# EAGLE design LED sign board 3 (EAGLE 7.2.0)
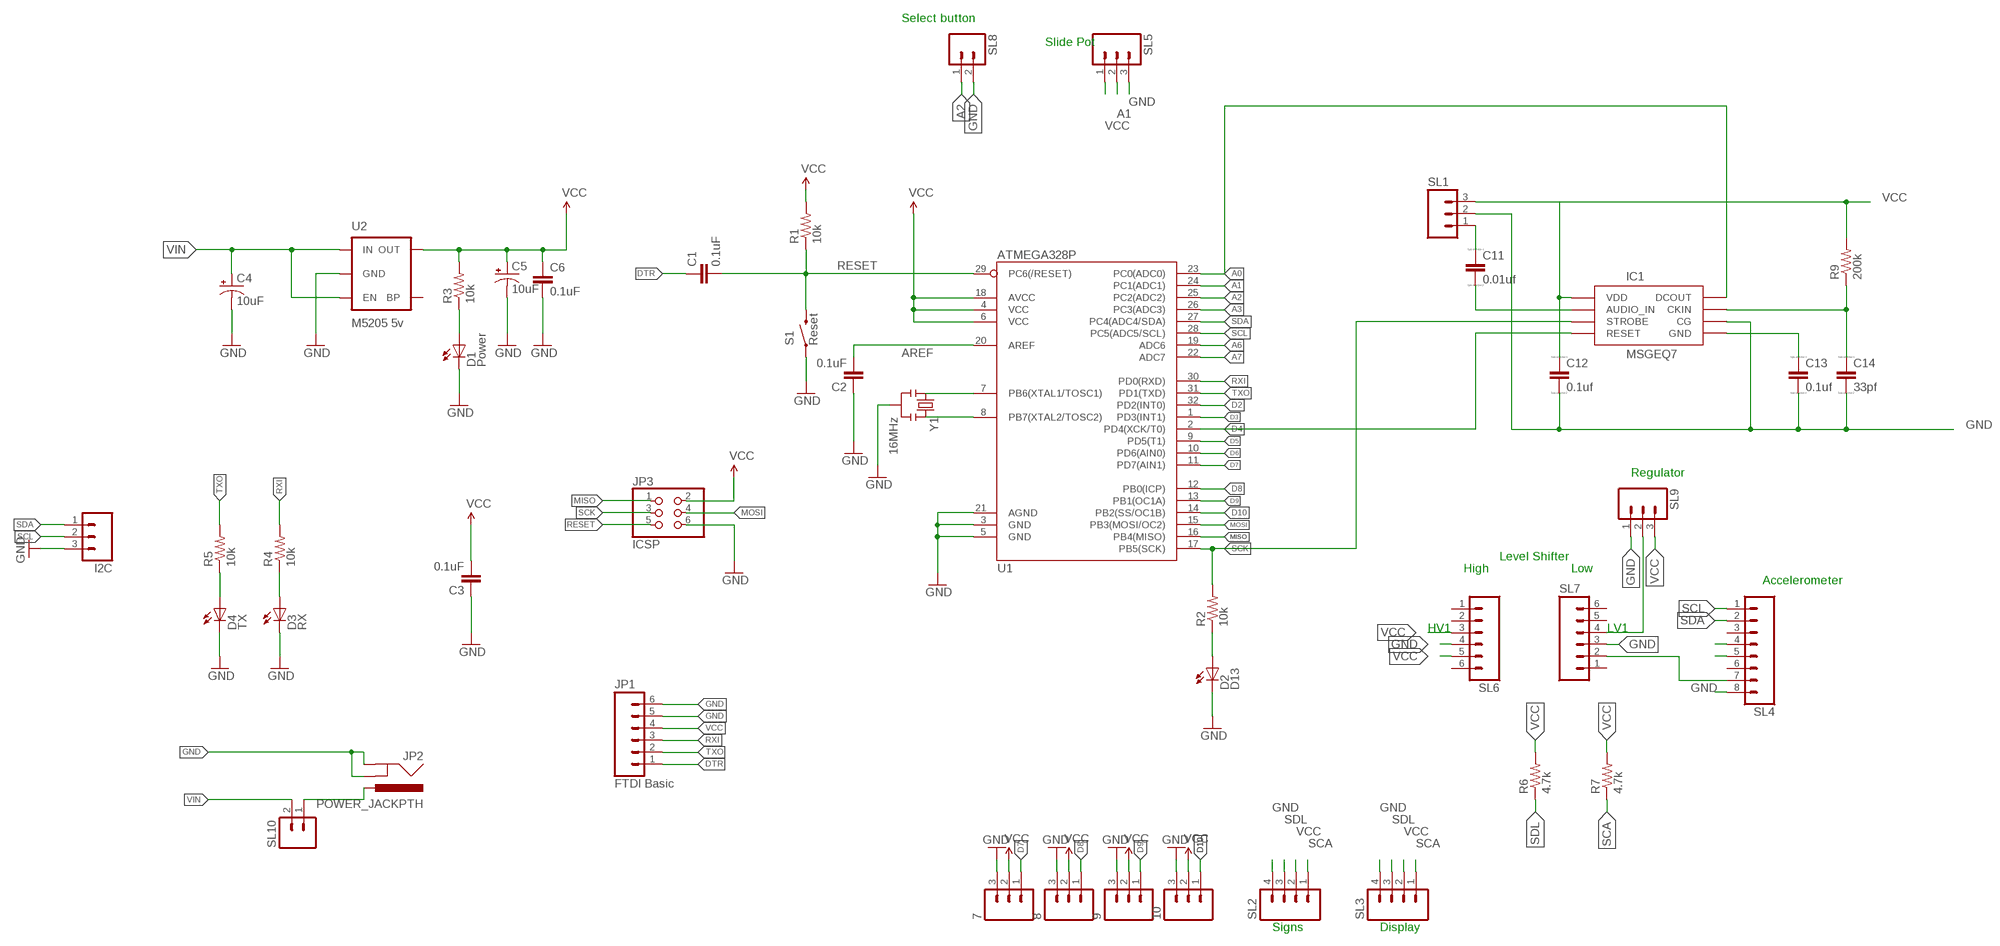
[diagram p0: schematic, sheet 1]

## Parts
7  M03PTH  [1X03]
8  M03PTH  [1X03]
9  M03PTH  [1X03]
10  M03PTH  [1X03]
C1  0.1uF  CAP0603-CAP  [0603-CAP]
C2  0.1uF  CAP0603-CAP  [0603-CAP]
C3  0.1uF  CAP0603-CAP  [0603-CAP]
C4  10uF  CAP_POL1206  [EIA3216]
C5  10uF  CAP_POL1206  [EIA3216]
C6  0.1uF  CAP0603-CAP  [0603-CAP]
C11  0.01uf  CC0201  [C0201]
C12  0.1uf  CC0201  [C0201]
C13  0.1uf  CC0201  [C0201]
C14  33pf  CC0201  [C0201]
D1  Power  LED-RED0603  [LED-0603]
D2  D13  LED-RED0603  [LED-0603]
D3  RX  LED-GREEN0603  [LED-0603]
D4  TX  LED-RED0603  [LED-0603]
I2C  M03PTH  [1X03]
IC1  MSGEQ7DIL  [DIL-08]
JP1  FTDI Basic  M06SIP  [1X06]
JP2  POWER_JACKPTH  [POWER_JACK_PTH]
JP3  ICSP  PINHD-2X3  [2X03]
R1  10k  RESISTOR0603-RES  [0603-RES]
R2  10k  RESISTOR0603-RES  [0603-RES]
R3  10k  RESISTOR0603-RES  [0603-RES]
R4  10k  RESISTOR0603-RES  [0603-RES]
R5  10k  RESISTOR0603-RES  [0603-RES]
R6  4.7k  RESISTOR1206  [1206]
R7  4.7k  RESISTOR1206  [1206]
R9  200k  RESISTOR1206  [1206]
S1  Reset  SWITCH-MOMENTARY-2SMD  [TACTILE_SWITCH_SMD]
SL1  M03  [03P]
SL2  M04  [04P]
SL3  M04  [04P]
SL4  M08  [08P]
SL5  M03  [03P]
SL6  M06  [06P]
SL7  M06  [06P]
SL8  M02  [02P]
SL9  M03  [03P]
SL10  M02  [02P]
U1  ATMEGA328P  ATMEGA328_SMT  [TQFP32-08]
U2  M5205 5v  MIC52055V  [SOT23-5]
Y1  16MHz  RESONATOR16MHZ  [RESONATOR-SMD]

## Nets
A0: IC1.3(DCOUT) U1.23(PC0(ADC0))
A1: SL5.2 U1.24(PC1(ADC1))
A2: SL8.1 U1.25(PC2(ADC2))
A3: U1.26(PC3(ADC3))
A6: U1.19(ADC6)
A7: U1.22(ADC7)
AREF: C2.2 U1.20(AREF)
D2: U1.32(PD2(INT0))
D3: U1.1(PD3(INT1))
D4: IC1.7(RESET) U1.2(PD4(XCK/T0))
D5: U1.9(PD5(T1))
D6: U1.10(PD6(AIN0))
D7: 7.1 U1.11(PD7(AIN1))
D8: 8.1 U1.12(PB0(ICP))
D9: 9.1 U1.13(PB1(OC1A))
D10: 10.1 U1.14(PB2(SS/OC1B))
DTR: C1.1 JP1.1
GND: 7.3 8.3 9.3 10.3 C2.1 C3.1 C4.C(-) C5.C(-) C6.2 C12.2 C13.2 C14.2 D1.C D2.C D3.C D4.C I2C.3 IC1.6(CG) JP1.5 JP1.6 JP2.GND JP2.GNDBREAK JP3.6 S1.1 SL1.2 SL2.4 SL3.4 SL4.8 SL5.3 SL6.4 SL7.3 SL7.4 SL8.2 SL9.1 SL9.2 U1.3(GND) U1.5(GND) U1.21(AGND) U2.2(GND) Y1.2
MISO: JP3.1 U1.16(PB4(MISO))
MOSI: JP3.4 U1.15(PB3(MOSI/OC2))
N$1: U1.7(PB6(XTAL1/TOSC1)) Y1.1
N$2: U1.8(PB7(XTAL2/TOSC2)) Y1.3
N$3: D1.A R3.1
N$4: D2.A R2.1
N$5: D3.A R4.1
N$6: D4.A R5.1
N$7: SL4.7 SL7.2
N$8: JP2.PWR SL10.1
N$9: C11.1 SL1.1
N$10: C11.2 IC1.5(AUDIO_IN)
N$11: C13.1 IC1.2(GND)
N$12: C14.1 IC1.8(CKIN) R9.1
N$14: SL4.5
N$15: SL4.4
RESET: C1.2 JP3.5 R1.1 S1.3 U1.29(PC6(/RESET))
RXI: JP1.3 R4.2 U1.30(PD0(RXD))
SCA: R7.1 SL2.1 SL3.1
SCK: IC1.4(STROBE) JP3.3 R2.2 U1.17(PB5(SCK))
SCL: I2C.2 SL4.1 U1.28(PC5(ADC5/SCL))
SDA: I2C.1 SL4.2 U1.27(PC4(ADC4/SDA))
SDL: R6.1 SL2.3 SL3.3
TXO: JP1.2 R5.2 U1.31(PD1(TXD))
VCC: 7.2 8.2 9.2 10.2 C3.2 C5.A(+) C6.1 C12.1 IC1.1(VDD) JP1.4 JP3.2 R1.2 R3.2 R6.2 R7.2 R9.2 SL1.3 SL2.2 SL3.2 SL5.1 SL6.3 SL6.5 SL9.3 U1.4(VCC) U1.6(VCC) U1.18(AVCC) U2.5(OUT)
VIN: C4.A(+) SL10.2 U2.1(IN) U2.3(EN)
Unconnected: SL4.3 SL4.6 SL6.1 SL6.2 SL6.6 SL7.1 SL7.5 SL7.6 U2.4(BP)

## Notes on the sheet
- Select button
- Slide Pot
- Regulator
- Level Shifter
- High | Low
- Accelerometer
- HV1 | LV1
- Signs | Display

## Library data of the parts
7-10 I2C = SparkFun-Connectors:M03: Header 3 Standard 3-pin 0.1" header. Use with straight break away headers (SKU : PRT-00116), right angle break away headers (PRT-00553), swiss pins (PRT-00743), machine pins (PRT-00117), and female headers (PRT-00115). Molex polarized connector foot print use with SKU : PRT-08232 with associated crimp pins and housings.
C1-C3 C6 = SparkFun-Passives:CAP: Capacitor Standard 0603 ceramic capacitor, and 0.1" leaded capacitor.
C4 C5 = SparkFun-Passives:CAP_POL: Capacitor Polarized These are standard SMD and PTH capacitors. Normally 10uF, 47uF, and 100uF in electrolytic and tantalum varieties. Always verify the external diameter of the through hole cap, it varies with capacity, voltage, and manufacturer. The EIA devices should be standard.
C11-C14 = eagle-ltspice:C: CAPACITOR, European symbol; SPICEMODEL: NONE; SPICEPREFIX: C
D1 D2 D4 = SparkFun-LED:LED-RED: Assorted Red LEDs LilyPad 1206- DIO-09912 1206- DIO-00809 0603- DIO-00819; PROD_ID: DIO-00819; VALUE: RED
D3 = SparkFun-LED:LED-GREEN: Various green LEDs Green LEDs used in SFE Production 0603- DIO-00821 LARGE- DIO-00862 LILYPAD- DIO-09910; PROD_ID: DIO-00821; VALUE: GREEN
IC1 = SparkFun-AnalogIC:MSGEQ7: 7-band graphic equalizer
JP1 = SparkFun-Connectors:M06: Header 6 Standard 6-pin 0.1" header. Use with straight break away headers (SKU : PRT-00116), right angle break away headers (PRT-00553), swiss pins (PRT-00743), machine pins (PRT-00117), and female headers (PRT-00115). Molex polarized connector foot print use with SKU : PRT-08094 with associated crimp pins and housings. NOTES ON THE VARIANTS LOCK and LOCK_LONGPADS... This footprint was designed to help hold the alignment of a through-hole component (i.e. 6-pin header) while soldering it into place. You may notice that each hole has been shifted either up or down by 0.005 of an inch from it's more standard position (which is a perfectly straight line). This slight alteration caused the pins (the squares in the middle) to touch the edges of the holes. Because they are alternating, it causes a "brace" to hold the component in place. 0.005 has proven to be the perfect amount of "off-center" position when using our standard breakaway headers. Although looks a little odd when you look at the bare footprint, once you have a header in there, the alteration is very hard to notice. Also,if you push a header all the way into place, it is covered up entirely on the bottom side. This idea of altering the position of holes to aid alignment will be further integrated into the Sparkfun Library for other footprints. It can help hold any component with 3 or more connection pins.
JP2 = SparkFun-Connectors:POWER_JACK: Power Jack This is the standard 5.5mm barrel jack for power. The PTH is the most common, proven, reliable, footprint. The Slot footprint only works if the mill layer is transmitted to the PCB fab house so be warned. Mating wall wart : TOL-00298 (and others); PROD_ID: CONN-08197
JP3 = SparkFun-Connectors:PINHD-2X3: PIN HEADER
R1-R5 = SparkFun-Passives:RESISTOR: Resistor Basic schematic elements and footprints for 0603, 1206, and PTH resistors.
R6 R7 R9 = SparkFun-Resistors:RESISTOR: Resistor Basic schematic elements and footprints for 0603, 1206, and PTH resistors.
S1 = SparkFun-Electromechanical:SWITCH-MOMENTARY-2: Various NO switches- pushbuttons, reed, etc; PROD_ID: SWCH-08247
SL1 SL5 SL9 = con-amp-quick:M03: AMP QUICK CONNECTOR; OC_FARNELL: unknown; OC_NEWARK: unknown
SL2 SL3 = con-amp-quick:M04: AMP QUICK CONNECTOR; OC_FARNELL: unknown; OC_NEWARK: unknown
SL4 = con-amp-quick:M08: AMP QUICK CONNECTOR; OC_FARNELL: unknown; OC_NEWARK: unknown
SL6 SL7 = con-amp-quick:M06: AMP QUICK CONNECTOR; OC_FARNELL: unknown; OC_NEWARK: unknown
SL8 SL10 = con-amp-quick:M02: AMP QUICK CONNECTOR; OC_FARNELL: unknown; OC_NEWARK: unknown
U1 = SparkFun-DigitalIC:ATMEGA328_SMT: 32-Pin Atmega328 part Commonly used on Arduino compatible boards Available in QFP and QFN packages TQFP is IC-09069 QFN is non-stock; PROD_ID: IC-09069
U2 = SparkFun-PowerIC:MIC5205: MIC5205 150mA vreg 3.3V - VREG-00822 5V - VREG-00823; PROD_ID: VREG-00823
Y1 = SparkFun-FreqCtrl:RESONATOR: Resonator Small SMD resonator. Used, eg, on the Arduino Pro/ Pro Mini boards. 8MHz- XTAL-08895 16MHz- XTAL-08900; PROD_ID: XTAL-08900

## Board
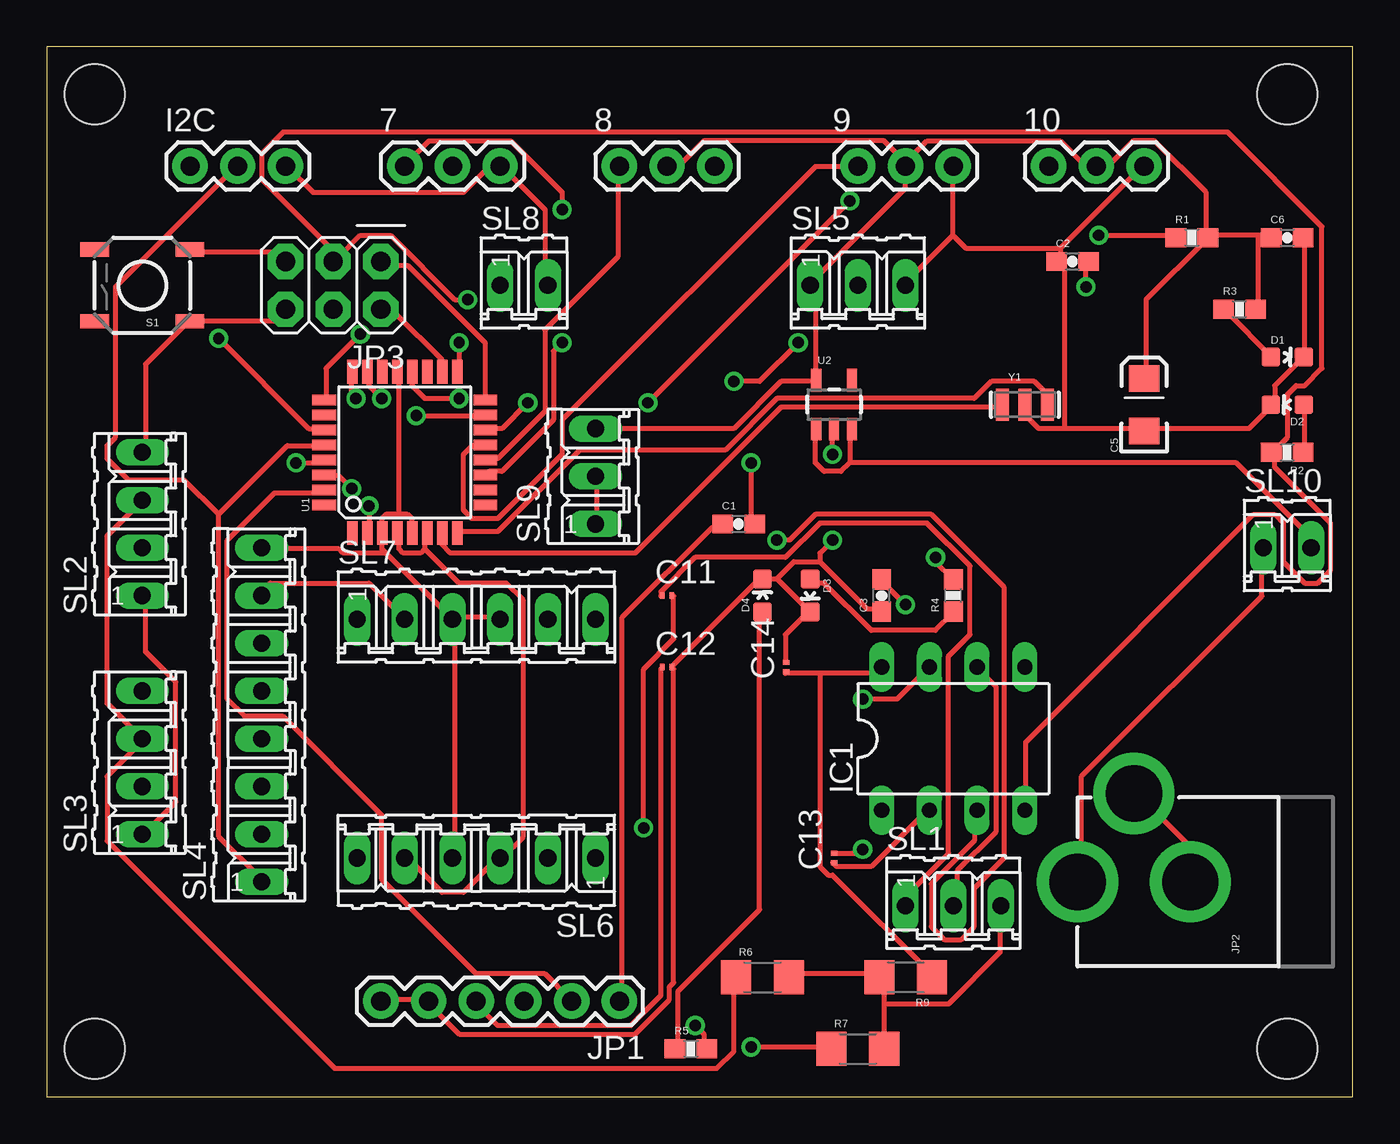
[diagram p1: board, top side]
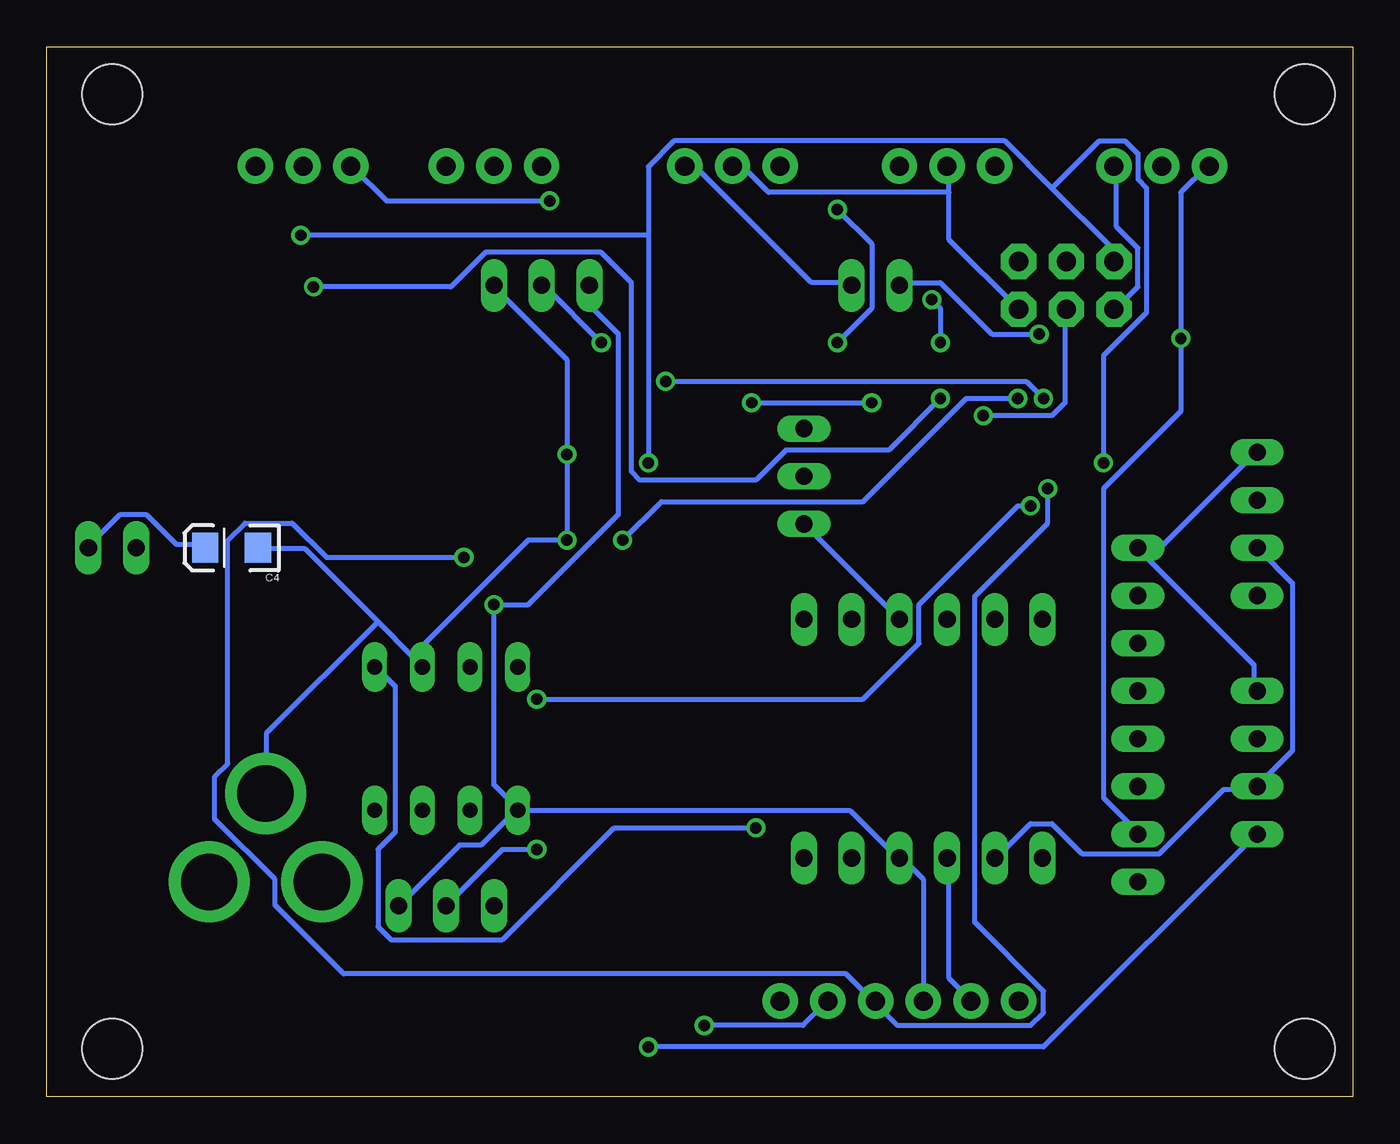
[diagram p2: board, bottom side, seen from below]

Size 69.52 x 55.87 mm. Coordinates in mm from the lower left corner, seen from the top.
Outline: 0,0 69.52,0 69.52,55.87 0,55.87 0,0
Copper layers (1*16): Top 0.035mm / dielectric 1.5mm / Bottom 0.035mm
Design rules "default": minimum track width 10mil, minimum drill 24mil, track to track 8mil, track to pad 8mil, pad to pad 8mil, via to via 8mil, smd to smd 8mil, copper to edge 40mil, drill to drill 8mil, minimum pad ring 10mil, minimum via ring 8mil, stop-mask expansion 4mil, vias tented up to drill 0mil, thermal gap 10mil
Holes 3.2 mm at 2.54,2.54 66.04,2.54 2.54,53.34 66.04,53.34

### Footprints (pad centres in the part's own frame; a part is rotated, then mirrored left to right if it is on the bottom)
1X03 = drill 1.016 pad 1.88: 1 0,0; 2 2.54,0; 3 5.08,0
0603-CAP = smd 1.1 x 1: 1 -0.85,0; 2 0.85,0
EIA3216 = smd 1.4 x 1.6: A 1.4,0; C -1.4,0
C0201 = smd 0.25 x 0.35: 1 -0.25,0; 2 0.25,0
LED-0603 = smd 1 x 1: A 0,-0.877; C 0,0.877
DIL-08 = drill 0.813 long: 1 -3.81,-3.81; 2 -1.27,-3.81; 3 1.27,-3.81; 4 3.81,-3.81; 5 3.81,3.81; 6 1.27,3.81; 7 -1.27,3.81; 8 -3.81,3.81
1X06 = drill 1.016 pad 1.88: 1 0,0; 2 2.54,0; 3 5.08,0; 4 7.62,0; 5 10.16,0; 6 12.7,0
POWER_JACK_PTH = drill 2.997 pad 4.318: GND 0,7.7; GNDBREAK 4.7,10.7; PWR 0,13.7
2X03 = drill 1.016 pad 1.88 octagon: 1 -2.54,-1.27; 2 -2.54,1.27; 3 0,-1.27; 4 0,1.27; 5 2.54,-1.27; 6 2.54,1.27
0603-RES = smd 1.1 x 1: 1 -0.85,0; 2 0.85,0
1206 = smd 1.6 x 1.8: 1 -1.4,0; 2 1.4,0
TACTILE_SWITCH_SMD = smd 1.524 x 0.762: 1 -2.54,1.905; 2 2.54,1.905; 3 -2.54,-1.905; 4 2.54,-1.905
03P = drill 0.914 long: 1 -2.54,0; 2 0,0; 3 2.54,0
04P = drill 0.914 long: 1 -3.81,0; 2 -1.27,0; 3 1.27,0; 4 3.81,0
08P = drill 0.914 long: 1 -8.89,0; 2 -6.35,0; 3 -3.81,0; 4 -1.27,0; 5 1.27,0; 6 3.81,0; 7 6.35,0; 8 8.89,0
06P = drill 0.914 long: 1 -6.35,0; 2 -3.81,0; 3 -1.27,0; 4 1.27,0; 5 3.81,0; 6 6.35,0
02P = drill 0.914 long: 1 -1.27,0; 2 1.27,0
TQFP32-08 = smd 1.27 x 0.559: 1 -4.293,2.8; 2 -4.293,2; 3 -4.293,1.2; 4 -4.293,0.4; 5 -4.293,-0.4; 6 -4.293,-1.2; 7 -4.293,-2; 8 -4.293,-2.8; 17 4.293,-2.8; 18 4.293,-2; 19 4.293,-1.2; 20 4.293,-0.4; 21 4.293,0.4; 22 4.293,1.2; 23 4.293,2; 24 4.293,2.8 | smd 0.559 x 1.27: 9 -2.8,-4.293; 10 -2,-4.293; 11 -1.2,-4.293; 12 -0.4,-4.293; 13 0.4,-4.293; 14 1.2,-4.293; 15 2,-4.293; 16 2.8,-4.293; 25 2.8,4.293; 26 2,4.293; 27 1.2,4.293; 28 0.4,4.293; 29 -0.4,4.293; 30 -1.2,4.293; 31 -2,4.293; 32 -2.8,4.293
SOT23-5 = smd 0.55 x 1.2: 1 -0.95,-1.3; 2 0,-1.3; 3 0.95,-1.3; 4 0.95,1.3; 5 -0.95,1.3
RESONATOR-SMD = smd 0.7 x 1.7: 1 -1.2,0; 2 0,0; 3 1.2,0

### Placement (x,y rotation side)
7  19.05,49.53 0 top
8  30.48,49.53 0 top
9  43.18,49.53 0 top
10  53.34,49.53 0 top
C1  36.83,30.48 0 top
C2  54.61,44.45 0 top
C3  44.45,26.67 90 top
C4  59.69,29.21 180 bottom
C5  58.42,36.83 90 top
C6  66.04,45.72 0 top
C11  33.02,26.67 0 top
C12  33.02,22.86 0 top
C13  41.91,12.7 90 top
C14  39.37,22.86 90 top
D1  66.04,39.37 270 top
D2  66.04,36.83 90 top
D3  40.64,26.67 180 top
D4  38.1,26.67 0 top
I2C  7.62,49.53 0 top
IC1  48.26,19.05 0 top
JP1  30.48,5.08 180 top
JP2  68.58,11.43 90 top
JP3  15.24,43.18 180 top
R1  60.96,45.72 0 top
R2  66.04,34.29 180 top
R3  63.5,41.91 0 top
R4  48.26,26.67 90 top
R5  34.29,2.54 0 top
R6  38.1,6.35 0 top
R7  43.18,2.54 0 top
R9  45.72,6.35 180 top
S1  5.08,43.18 180 top
SL1  48.26,10.16 0 top
SL2  5.08,30.48 90 top
SL3  5.08,17.78 90 top
SL4  11.43,20.32 90 top
SL5  43.18,43.18 0 top
SL6  22.86,12.7 180 top
SL7  22.86,25.4 0 top
SL8  25.4,43.18 0 top
SL9  29.21,33.02 90 top
SL10  66.04,29.21 0 top
U1  19.05,34.29 90 top
U2  41.91,36.83 0 top
Y1  52.07,36.83 0 top

### Tracks (layer width: path | path; a pad name or v marks a point on that pad's centre or on a via)
A0  (via drill 0.61)
  Top 0.254: v17.83,37.16 17.14,37.85 17.14,38.53 U1.23 | v38.86,29.62 39.55,29.62 40.92,30.99 47.09,30.99 50.98,27.1 50.98,12.7 49.38,11.1 49.38,9.04 48.69,8.36 47.78,8.36 47.09,9.04 47.09,11.33 49.38,13.61 49.38,15.21 IC1.3
  Bottom 0.254: v17.83,37.16 20.57,37.16 26.06,31.67 36.8,31.67 v38.86,29.62
A1  (via drill 0.61)
  Top 0.254: v16.46,37.16 16.23,37.39 16.23,38.53 U1.24 | v36.58,38.08 37.95,38.08 v40.01,40.13
  Bottom 0.254: v16.46,37.16 17.37,38.08 v36.58,38.08 | v40.01,40.13 42.98,43.1 SL5.2
A2  (via drill 0.61)
  Top 0.254: v16.69,40.59 14.86,38.76 14.86,37.16 U1.25
  Bottom 0.254: v16.69,40.59 19.2,40.59 21.95,43.33 24,43.33 SL8.1
AREF  (via drill 0.61)
  Top 0.254: v55.32,43.1 55.32,44.25 C2.2 | v21.95,37.16 20.12,37.16 19.43,37.85 19.43,38.53 U1.20
  Bottom 0.254: v55.32,43.1 48.01,43.1 46.18,44.93 40.01,44.93 38.41,43.33 38.41,33.27 37.95,32.82 31.77,32.82 30.18,34.42 24.69,34.42 v21.95,37.16
D4  (via drill 0.61)
  Top 0.254: v17.14,31.45 17.14,30.07 U1.2 | v43.43,21.16 45.26,21.16 46.86,22.76 IC1.7
  Bottom 0.254: v17.14,31.45 17.83,31.45 23.09,26.19 23.09,24.13 26.06,21.16 v43.43,21.16
D7  (via drill 0.61)
  Top 0.254: v27.43,40.13 26.98,39.68 26.98,36.02 24.23,33.27 23.55,33.27 U1.11 | v27.43,47.22 27.43,48.13 24.69,50.88 20.34,50.88 19.2,49.73 7.1
  Bottom 0.254: v27.43,40.13 25.6,41.96 25.6,45.39 v27.43,47.22
D8
  Top 0.254: U1.12 23.55,33.96 24,33.96 26.52,36.47 26.52,40.82 30.4,44.7 30.4,49.51 8.1
D9
  Top 0.254: U1.13 23.32,34.65 22.63,34.65 22.17,34.19 22.17,31.22 22.63,30.76 24,30.76 27.43,34.19 27.43,36.02 40.92,49.51 42.98,49.51 9.1
D10  (via drill 0.61)
  Top 0.254: v25.6,36.93 24.23,35.56 23.55,35.56 U1.14 | v42.75,47.68 v32,36.93
  Bottom 0.254: v32,36.93 v25.6,36.93 | v42.75,47.68 51.44,47.68 53.26,49.51 10.1
DTR
  Top 0.254: C1.1 35.89,30.3 35.43,30.3 30.63,25.5 30.63,5.16 JP1.1
GND  (via drill 0.61)
  Top 0.254: JP2.GND 60.81,11.56 60.81,13.39 58.06,16.13 JP2.GNDBREAK | v43.43,13.16 43.2,12.93 42.06,12.93 C13.2 | SL1.2 48.46,10.18 48.46,12.01 50.52,14.07 50.52,21.84 49.61,22.76 IC1.6 | C6.2 66.98,45.62 66.98,39.45 D1.C 66.75,39.22 65.38,37.85 65.38,36.93 D2.C 65.15,36.7 64.01,35.56 58.52,35.56 C5.C 58.29,35.56 54.18,35.56 | 54.18,35.56 52.81,35.56 52.12,36.25 52.12,36.7 Y1.2 | C14.2 39.32,23.22 39.32,24.59 40.46,25.73 D3.C 40.46,25.96 38.86,27.56 | 41.15,28.47 43.66,25.96 44.35,25.96 C3.1 | 41.15,28.47 39.78,28.47 38.86,27.56 | 38.86,27.56 38.18,27.56 D4.C 37.95,27.56 33.38,22.99 C12.2 33.38,22.76 33.38,6.07 33.15,5.84 33.15,5.16 31.32,3.33 21.95,3.33 20.34,4.93 JP1.5 20.12,5.16 17.83,5.16 JP1.6 | 53.95,45.16 53.95,44.48 C2.1 53.95,44.25 54.18,44.02 54.18,35.56 | 53.95,45.16 58.29,49.51 10.3 | v41.83,34.19 41.83,35.33 U2.2 | 48.23,45.85 48.23,49.51 9.3 | 48.23,45.85 45.72,43.33 SL5.3 | 53.95,45.16 48.92,45.16 48.23,45.85 | 41.15,28.47 41.15,28.93 v41.83,29.62 | SL8.2 26.52,43.33 26.52,47.22 24.23,49.51 7.3 24,49.51 23.55,49.51 22.17,48.13 14.17,48.13 12.8,49.51 I2C.3 | JP3.6 12.57,41.73 12.12,41.28 S1.1 7.54,41.28 5.26,38.99 5.26,34.42 SL2.4 | SL9.1 29.26,30.53 29.26,32.82 SL9.2 | SL7.3 21.72,25.5 24,25.5 SL7.4 | 18.75,30.99 19.2,30.99 19.43,30.76 19.43,30.07 U1.5 | 18.75,30.99 18.06,30.99 17.83,30.76 17.83,30.07 U1.3 17.83,29.84 17.83,29.16 18.06,28.93 | 18.75,30.99 18.75,38.53 U1.21 | 18.06,28.93 SL7.3 | SL6.4 21.72,12.7 21.72,25.27 SL7.3 | 18.06,28.93 15.77,28.93 15.54,29.16 11.43,29.16 SL4.8
  Bottom 0.254: v43.43,13.16 45.26,13.16 SL1.2 | 50.06,23.44 49.61,22.99 IC1.6 50.06,23.44 | 50.06,23.44 51.89,25.27 | 51.89,25.27 55.78,29.16 58.06,29.16 C4.C | 51.89,25.27 57.84,19.33 57.84,16.36 JP2.GNDBREAK | SL5.3 45.72,43.1 41.83,39.22 v41.83,34.19 v41.83,29.62 43.89,29.62 50.06,23.44 | 8.3 35.43,49.51 34.98,49.51 28.8,43.33 26.75,43.33 SL8.2 | I2C.3 12.57,49.51 12.57,46.3 11.43,45.16 11.43,43.1 12.57,41.96 JP3.6 | 10.97,28.7 11.43,29.16 SL4.8 10.97,28.7 | 10.97,28.7 5.26,22.99 5.26,21.61 SL3.4 | SL6.4 21.49,12.7 21.49,6.3 20.34,5.16 JP1.5 | SL7.4 SL9.1 | 10.97,28.7 10.74,28.7 5.26,34.19 SL2.4
MISO
  Top 0.254: U1.16 23.32,37.16 23.32,40.13 19.2,44.25 17.83,44.25 JP3.1
MOSI  (via drill 0.61)
  Top 0.254: v19.66,36.25 23.32,36.25 U1.15
  Bottom 0.254: v19.66,36.25 16,36.25 15.32,36.93 15.32,41.73 JP3.4
N$1
  Top 0.254: U1.7 21.03,29.84 21.03,29.39 21.49,28.93 31.32,28.93 39.09,36.7 50.75,36.7 Y1.1
N$2
  Top 0.254: U1.8 21.95,30.07 24,30.07 28.35,34.42 36.12,34.42 38.86,37.16 49.38,37.16 50.29,38.08 52.58,38.08 53.26,37.39 53.26,36.93 Y1.3
N$3
  Top 0.254: D1.A 65.15,39.45 62.87,41.73 R3.1
N$4
  Top 0.254: D2.A 66.98,36.7 66.98,34.42 R2.1
N$5
  Top 0.254: D3.A 40.69,27.33 41.38,27.33 43.89,24.82 47.32,24.82 48.23,25.73 R4.1
N$6
  Top 0.254: D4.A 37.95,25.73 37.95,9.96 33.6,5.61 33.6,2.64 R5.1
N$7
  Top 0.254: SL7.2 18.97,25.5 17.14,27.33 11.89,27.33 11.43,26.87 SL4.7
N$8
  Top 0.254: SL10.1 64.69,29.16 64.69,26.64 55.09,17.04 55.09,11.56 JP2.PWR
N$9
  Top 0.254: SL1.1 45.72,10.64 48.01,12.93 48.01,23.44 49.15,24.59 49.15,28.25 46.86,30.53 41.15,30.53 39.32,28.7 34.52,28.7 32.69,26.87 32.69,26.64 C11.1
N$10  (via drill 0.61)
  Top 0.254: v31.77,14.3 31.77,22.76 33.38,24.36 33.38,26.64 C11.2
  Bottom 0.254: v31.77,14.3 39.32,14.3 45.26,8.36 51.21,8.36 51.89,9.04 51.89,13.16 50.98,14.07 50.98,21.84 51.89,22.76 IC1.5
N$11
  Top 0.254: C13.1 41.83,12.47 42.06,12.24 43.89,12.24 46.86,15.21 IC1.2
N$12
  Top 0.254: 41.15,22.53 44.12,22.53 IC1.8 | 41.15,22.53 39.32,22.53 C14.1 | 41.15,22.53 41.15,12.24 41.6,11.79 41.83,11.79 47.09,6.53 R9.1
RESET  (via drill 0.61)
  Top 0.254: v37.49,33.73 37.49,30.53 C1.2 | v56.01,45.85 59.89,45.85 R1.1 | v13.26,33.73 14.63,33.73 U1.29 | S1.3 7.77,44.93 12.12,44.93 12.57,44.48 JP3.5
  Bottom 0.254: 37.49,45.85 37.49,49.51 36.12,50.88 18.52,50.88 16,48.36 | 37.49,45.85 v37.49,33.73 | 16,48.36 12.8,45.16 12.8,44.48 JP3.5 | 37.49,45.85 v56.01,45.85 | v13.26,33.73 13.26,39.45 10.97,41.73 10.97,48.36 11.43,48.82 11.43,50.19 12.12,50.88 13.49,50.88 16,48.36
RXI  (via drill 0.61)
  Top 0.254: v47.32,28.7 47.32,28.47 48.23,27.56 R4.2 | v16.23,32.36 15.54,33.05 14.86,33.05 U1.30
  Bottom 0.254: v47.32,28.7 54.63,28.7 56.46,30.53 58.98,30.53 59.89,29.62 59.89,17.73 60.58,17.04 60.58,14.76 57.38,11.56 57.38,10.18 53.72,6.53 26.98,6.53 25.6,5.16 JP1.3 25.38,4.93 24.23,3.79 17.14,3.79 16.46,4.47 16.46,5.61 20.12,9.27 20.12,26.64 16.23,30.53 v16.23,32.36
SCA  (via drill 0.61)
  Top 0.254: v37.49,2.64 41.6,2.64 R7.1 | SL2.1 5.26,26.64 5.26,23.67 6.86,22.07 6.86,15.67 5.26,14.07 SL3.1
  Bottom 0.254: v37.49,2.64 16.46,2.64 5.26,13.84 SL3.1
SCK  (via drill 0.61)
  Top 0.254: v21.95,40.13 21.95,38.76 U1.17 | v22.4,42.42 21.72,42.42 18.29,45.85 16.69,45.85 15.54,44.7 | 15.54,44.7 15.32,44.48 JP3.3 15.54,44.7 | IC1.4 52.12,15.44 52.12,18.87 64.24,30.99 65.38,30.99 65.84,30.53 65.84,28.47 66.98,27.33 67.67,27.33 68.35,28.02 68.35,30.53 65.38,33.5 65.38,34.19 R2.2 65.38,34.42 66.06,35.1 66.06,37.39 66.52,37.85 66.98,37.85 67.89,38.76 67.89,46.3 62.87,51.33 12.57,51.33 11.43,50.19 11.43,48.82 15.54,44.7
  Bottom 0.254: v21.95,40.13 21.95,41.96 v22.4,42.42
SCL
  Top 0.254: 9.14,30.99 12.8,34.65 14.63,34.65 U1.28 | 9.14,30.99 9.14,13.84 11.43,11.56 SL4.1 | 9.14,30.99 7.32,32.82 4.34,32.82 3.2,33.96 3.2,34.65 3.66,35.1 3.66,43.1 10.06,49.51 I2C.2
SDA  (via drill 0.61)
  Top 0.254: v9.14,40.36 13.95,35.56 14.63,35.56 U1.27
  Bottom 0.254: I2C.1 7.77,49.51 9.14,48.13 v9.14,40.36 9.14,36.47 13.26,32.36 13.26,15.9 11.43,14.07 SL4.2
SDL
  Top 0.254: R6.1 36.58,6.3 36.58,2.41 35.66,1.5 15.32,1.5 3.2,13.61 3.2,17.04 5.03,18.87 SL3.3 3.2,20.93 3.2,29.84 5.03,31.67 SL2.3
TXO  (via drill 0.61)
  Top 0.254: v34.52,3.79 34.98,3.33 34.98,2.64 R5.2 | U1.31 14.63,32.13 12.12,32.13 9.6,29.62 9.6,21.16 10.52,20.24 12.57,20.24 17.83,14.99 17.83,11.56 22.86,6.53 26.52,6.53 27.89,5.16 JP1.2
  Bottom 0.254: v34.52,3.79 29.26,3.79 28.12,4.93 JP1.2
VCC  (via drill 0.61)
  Top 0.254: U1.18 21.03,38.76 21.03,39.22 18.52,41.73 17.83,41.73 JP3.2 | 64.47,45.85 65.15,45.85 C6.1 | 64.47,45.85 61.95,45.85 R1.2 | 64.47,45.85 64.47,41.96 R3.2 | C5.A 58.52,38.3 58.52,42.42 61.72,45.62 R1.2 | R1.2 61.72,45.85 61.72,48.13 58.98,50.88 57.84,50.88 56.69,49.73 56.01,49.73 10.2 55.78,49.73 55.09,49.73 53.95,50.88 46.86,50.88 45.72,49.73 | SL9.3 36.58,35.56 39.09,38.08 40.92,38.08 U2.5 40.92,38.3 40.92,42.88 40.69,43.1 SL5.1 40.69,43.33 45.72,48.36 9.2 45.72,49.73 | 45.72,49.73 44.58,50.88 34.98,50.88 33.83,49.73 33.15,49.73 8.2 | R6.2 39.55,6.53 44.12,6.53 R9.2 44.35,6.3 44.58,6.07 44.58,4.93 | 44.58,4.93 44.58,2.64 R7.2 | v45.72,26.19 44.58,27.33 C3.2 | 44.58,4.93 48.01,4.93 50.75,7.67 50.75,9.96 SL1.3 | C12.1 32.69,22.76 32.69,5.38 31.09,3.79 24,3.79 22.86,4.93 JP1.4 | 20.12,29.16 19.89,28.93 18.97,28.93 18.75,29.16 18.75,29.84 U1.4 | 20.12,29.16 20.12,29.84 U1.6 | 20.12,29.16 21.95,27.33 24.46,27.33 25.38,26.42 25.38,13.84 24.23,12.7 SL6.3 24,12.7 22.17,10.87 21.03,10.87 19.2,12.7 SL6.5
  Bottom 0.254: 21.49,48.13 21.49,45.62 JP3.2 | 21.49,48.13 21.49,49.51 7.2 | 21.49,48.13 31.09,48.13 32.46,49.51 32.92,49.51 8.2 | IC1.1 44.58,15.44 45.72,16.59 v45.72,26.19 43.89,26.19 39.09,30.99 39.09,40.59 40.46,41.96 40.46,43.1 SL5.1 | SL1.3 50.75,10.18 47.55,13.39 46.41,13.39 44.58,15.21 IC1.1 | SL2.2 3.2,27.33 3.2,18.41 5.03,16.59 SL3.2 5.26,16.36 6.86,16.36 10.29,12.93 14.4,12.93 16,14.53 17.14,14.53 18.97,12.7 SL6.5 | JP1.4 22.86,11.56 24,12.7 SL6.3 24.23,12.7 26.75,15.21 44.35,15.21 IC1.1
VIN
  Top 0.254: 42.75,33.73 42.29,33.27 41.38,33.27 40.92,33.73 40.92,35.33 U2.1 | 42.75,33.73 42.75,35.33 U2.3 | 42.75,33.73 63.32,33.73 67.21,29.84 67.21,29.39 SL10.2
  Bottom 0.254: C4.A 61.27,29.39 62.64,29.39 64.24,30.99 65.61,30.99 67.21,29.39 SL10.2